# Altium schematic sheet 2-FrontEnd.SchDoc
size A4
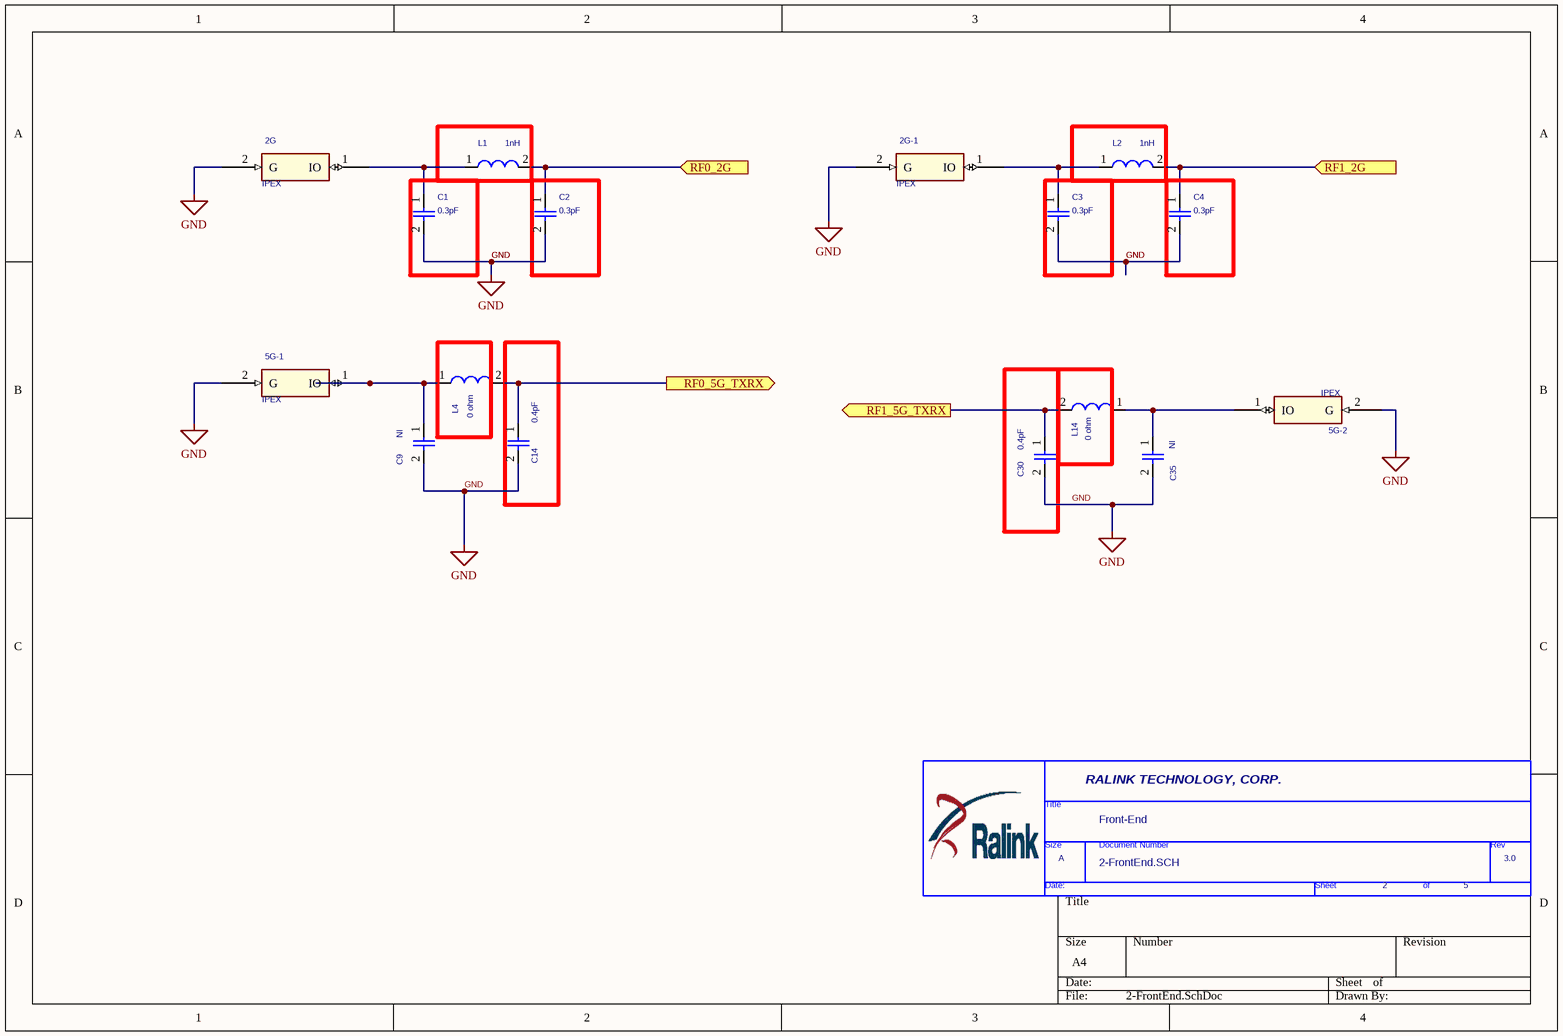
[diagram p0: 2-FrontEnd.SchDoc]

## Parts
2G  IPEX  [IPEX]
2G-1  IPEX  [IPEX]
5G-1  IPEX  [IPEX]
5G-2  IPEX  [IPEX]
*  Page Count: 5  Page Number: 2  Page Size: A  OrgName: RALINK TECHNOLOGY, CORP.  Title: Front-End  RevCode: 3.0  Doc: 2-FrontEnd.SCH  (hidden comment: TitleBlock1-RA-new)  (graphical)
C1  0.3pF  [0402]
C2  0.3pF  [0402]
C3  0.3pF  [0402]
C4  0.3pF  [0402]
C9  NI  [0402]
C14  0.4pF  [0402]
C30  0.4pF  [0402]
C35  NI  [0402]
L1  1nH  [0402]
L2  1nH  [0402]
L4  0 ohm  [0402]
L14  0 ohm  [0402]

## Ports
RF0_2G (in), RF0_5G_TXRX (out), RF1_2G (in), RF1_5G_TXRX (out)

## Nets
GND: 2G.2(G) 2G-1.2(G) 5G-1.2(G) 5G-2.2(G) C1.2 C2.2 C3.2 C4.2 C9.2 C14.2 C30.2 C35.2
RF0_2G: C2.1 L1.2 ; port RF0_2G
RF0_5G_TXRX: C14.1 L4.2 ; port RF0_5G_TXRX
RF1_2G: C4.1 L2.2 ; port RF1_2G
RF1_5G_TXRX: C30.1 L14.2 ; port RF1_5G_TXRX
Net2G-1_1: 2G-1.1(IO) C3.1 L2.1
Net2G_1: 2G.1(IO) C1.1 L1.1
Net5G-1_1: 5G-1.1(IO) C9.1 L4.1
Net5G-2_1: 5G-2.1(IO) C35.1 L14.1

## Notes on the sheet
- (in symbol TitleBlock1-RA-new) Title; Size; Document Number; Rev; Date:; Sheet; of

## Library data of the parts
2G 2G-1 5G-1 5G-2 = ANT-RA-USB-1
C1-C4 C9 C14 C30 C35 = CAP/0402
L1 L2 L4 L14 = L/0402
* = TitleBlock1-RA-new: Page Create Date: March  8, 1995